# EAGLE board RastoBot-r1 (EAGLE 9.6.2), part 1 of 3
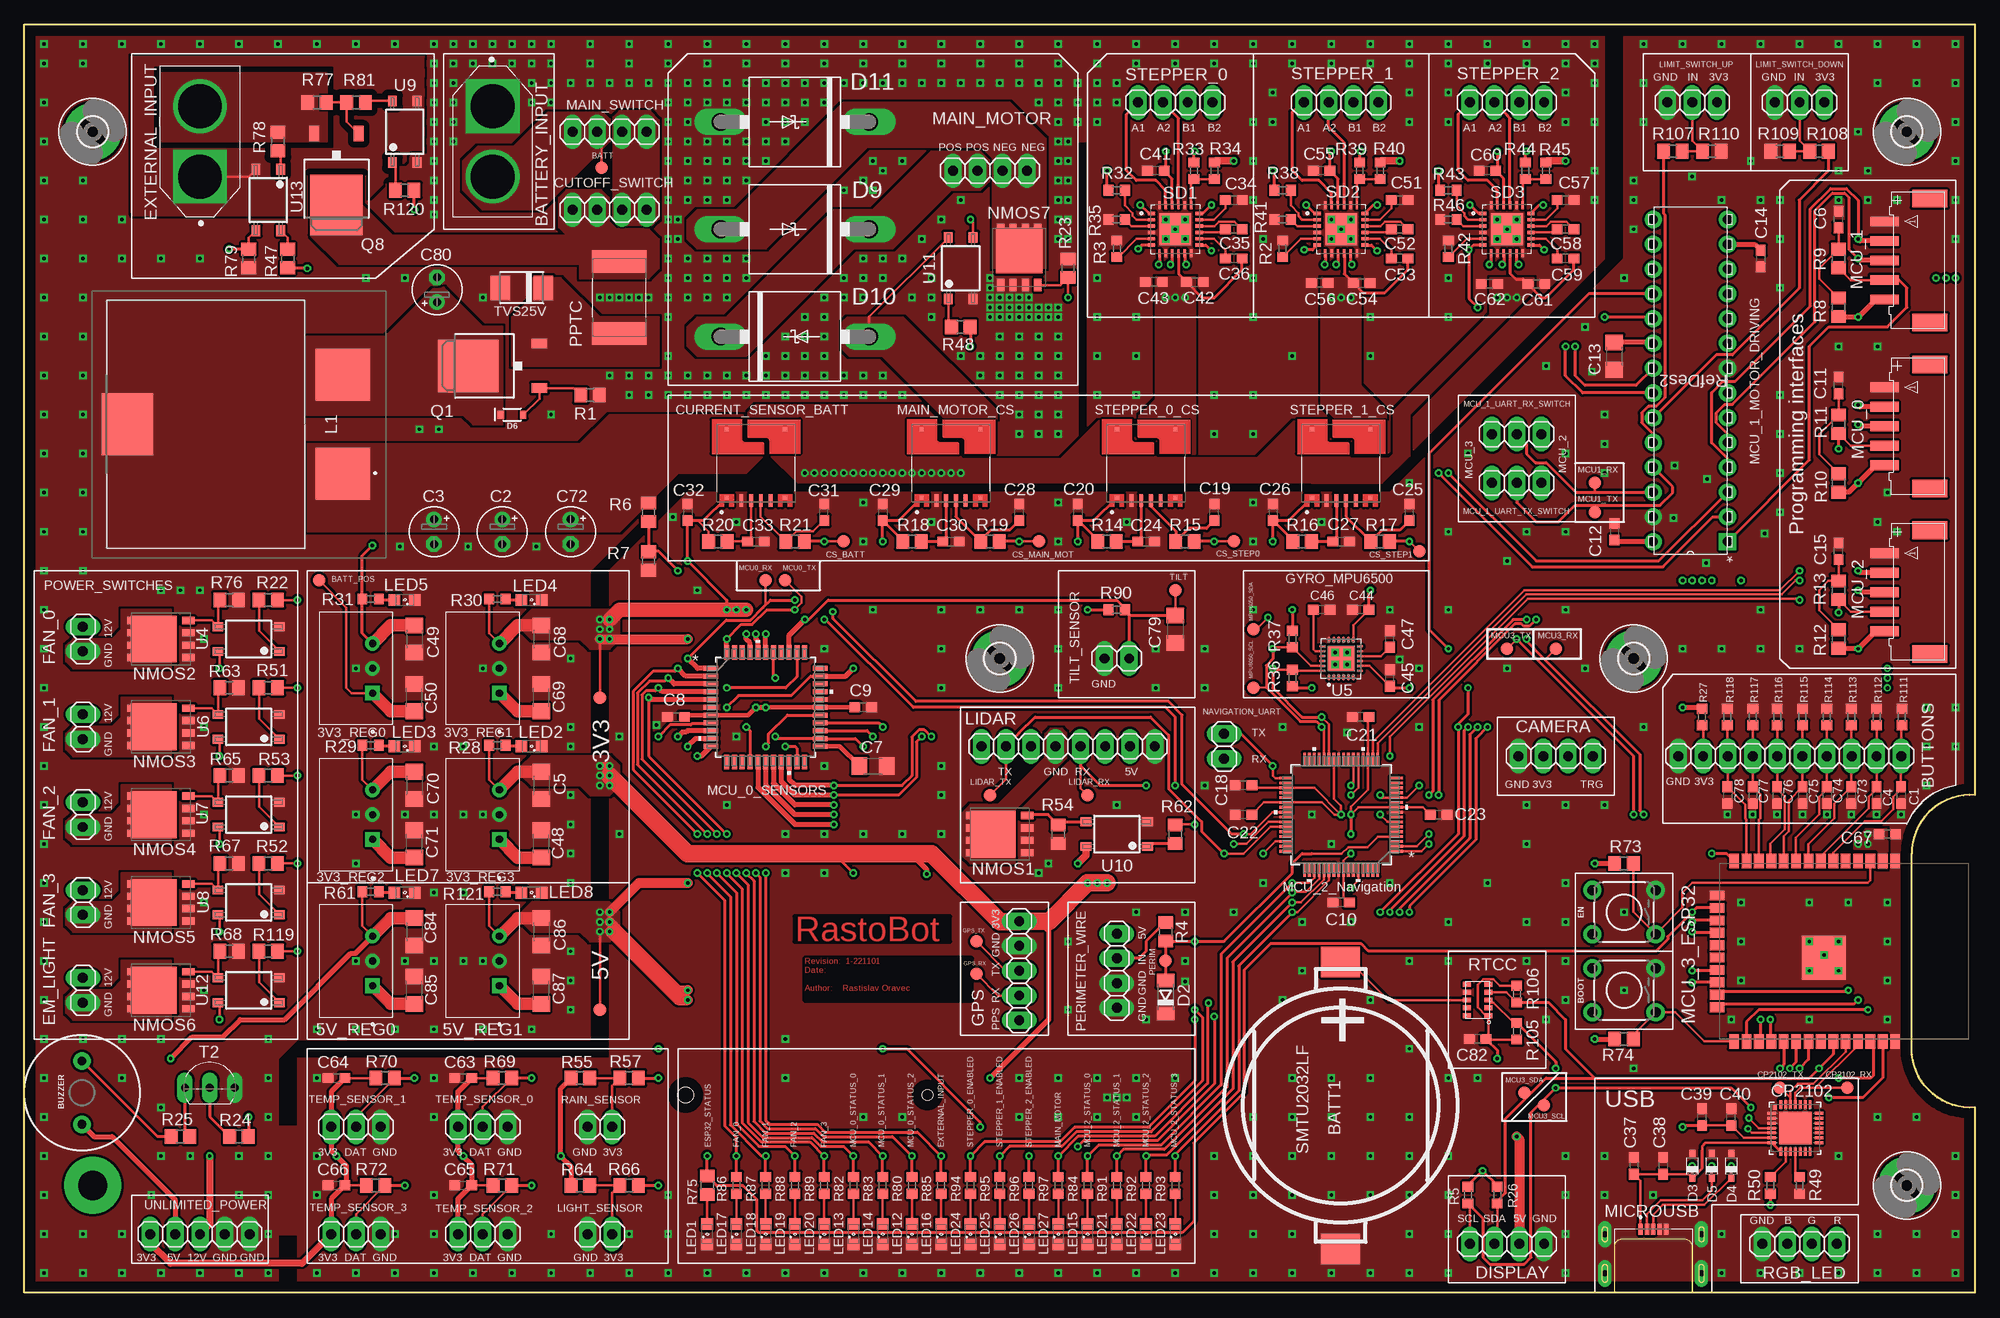
[diagram p11: board, top side]
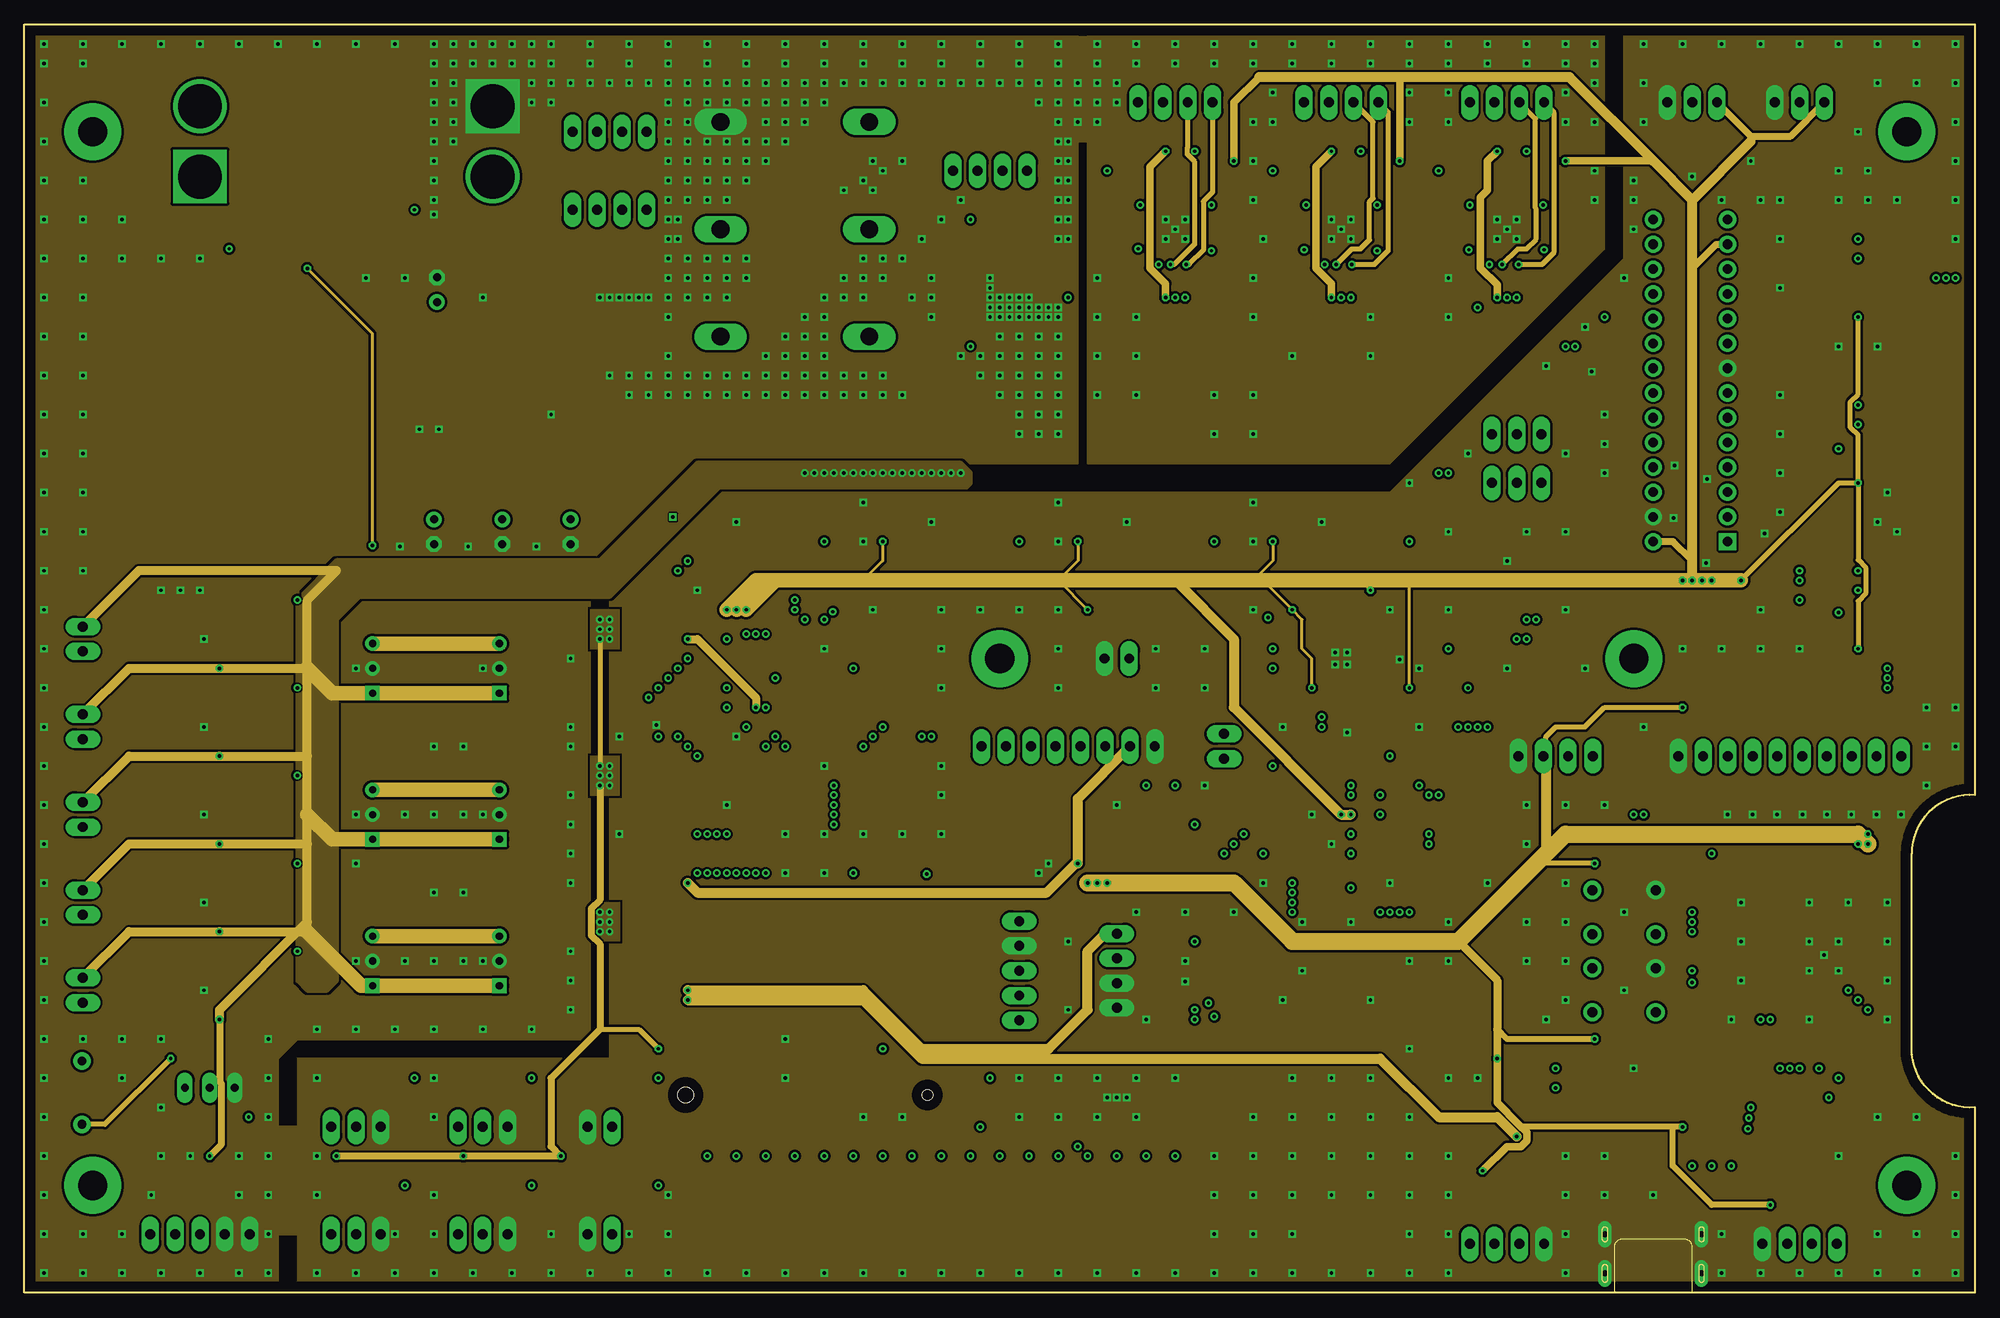
[diagram p12: board, inner layer Route2]
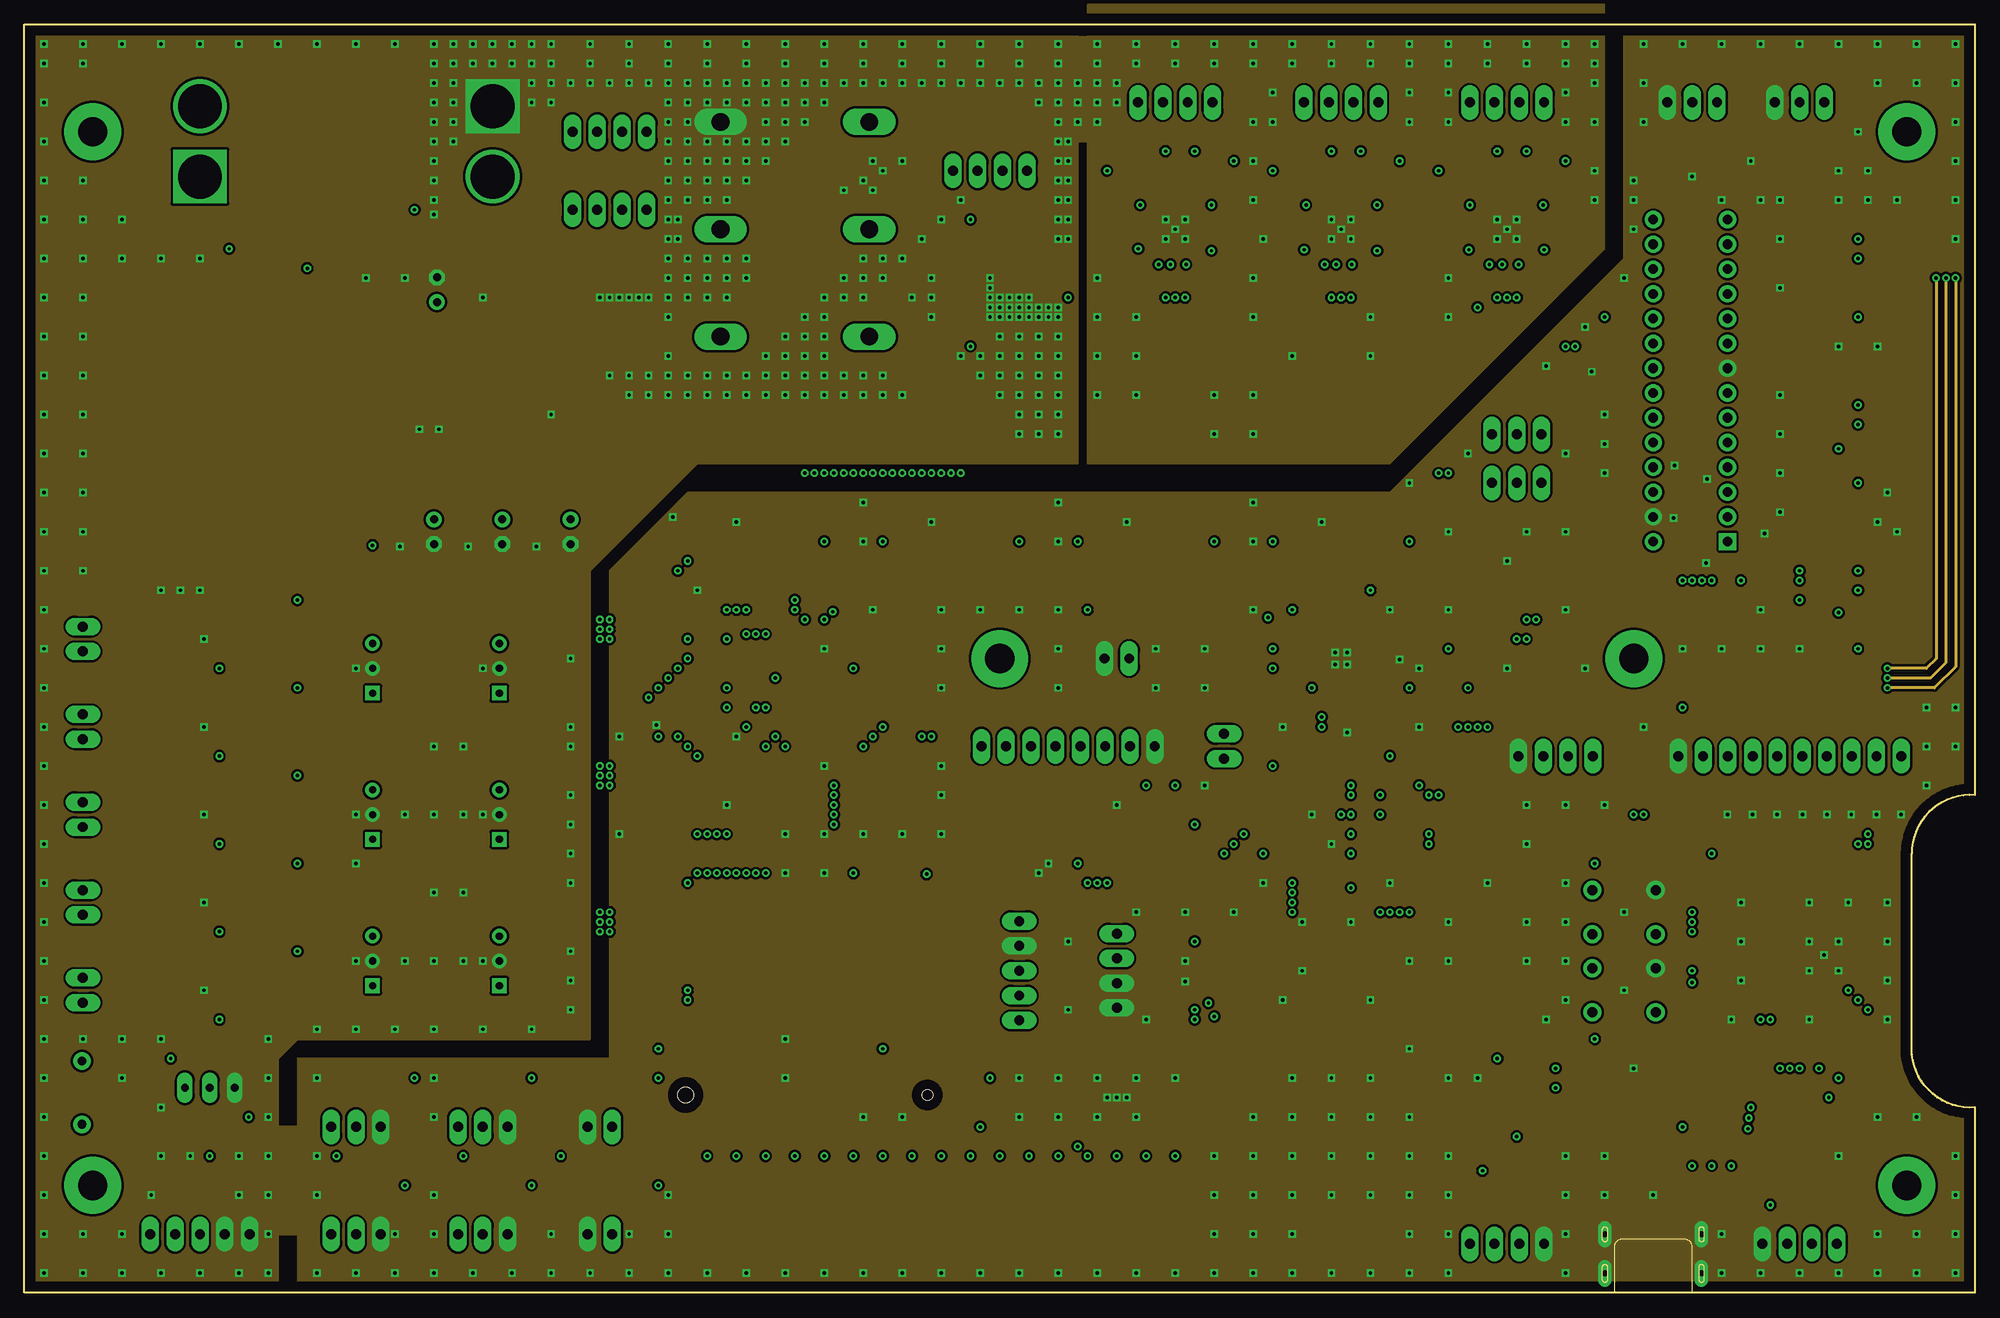
[diagram p13: board, inner layer Route15]
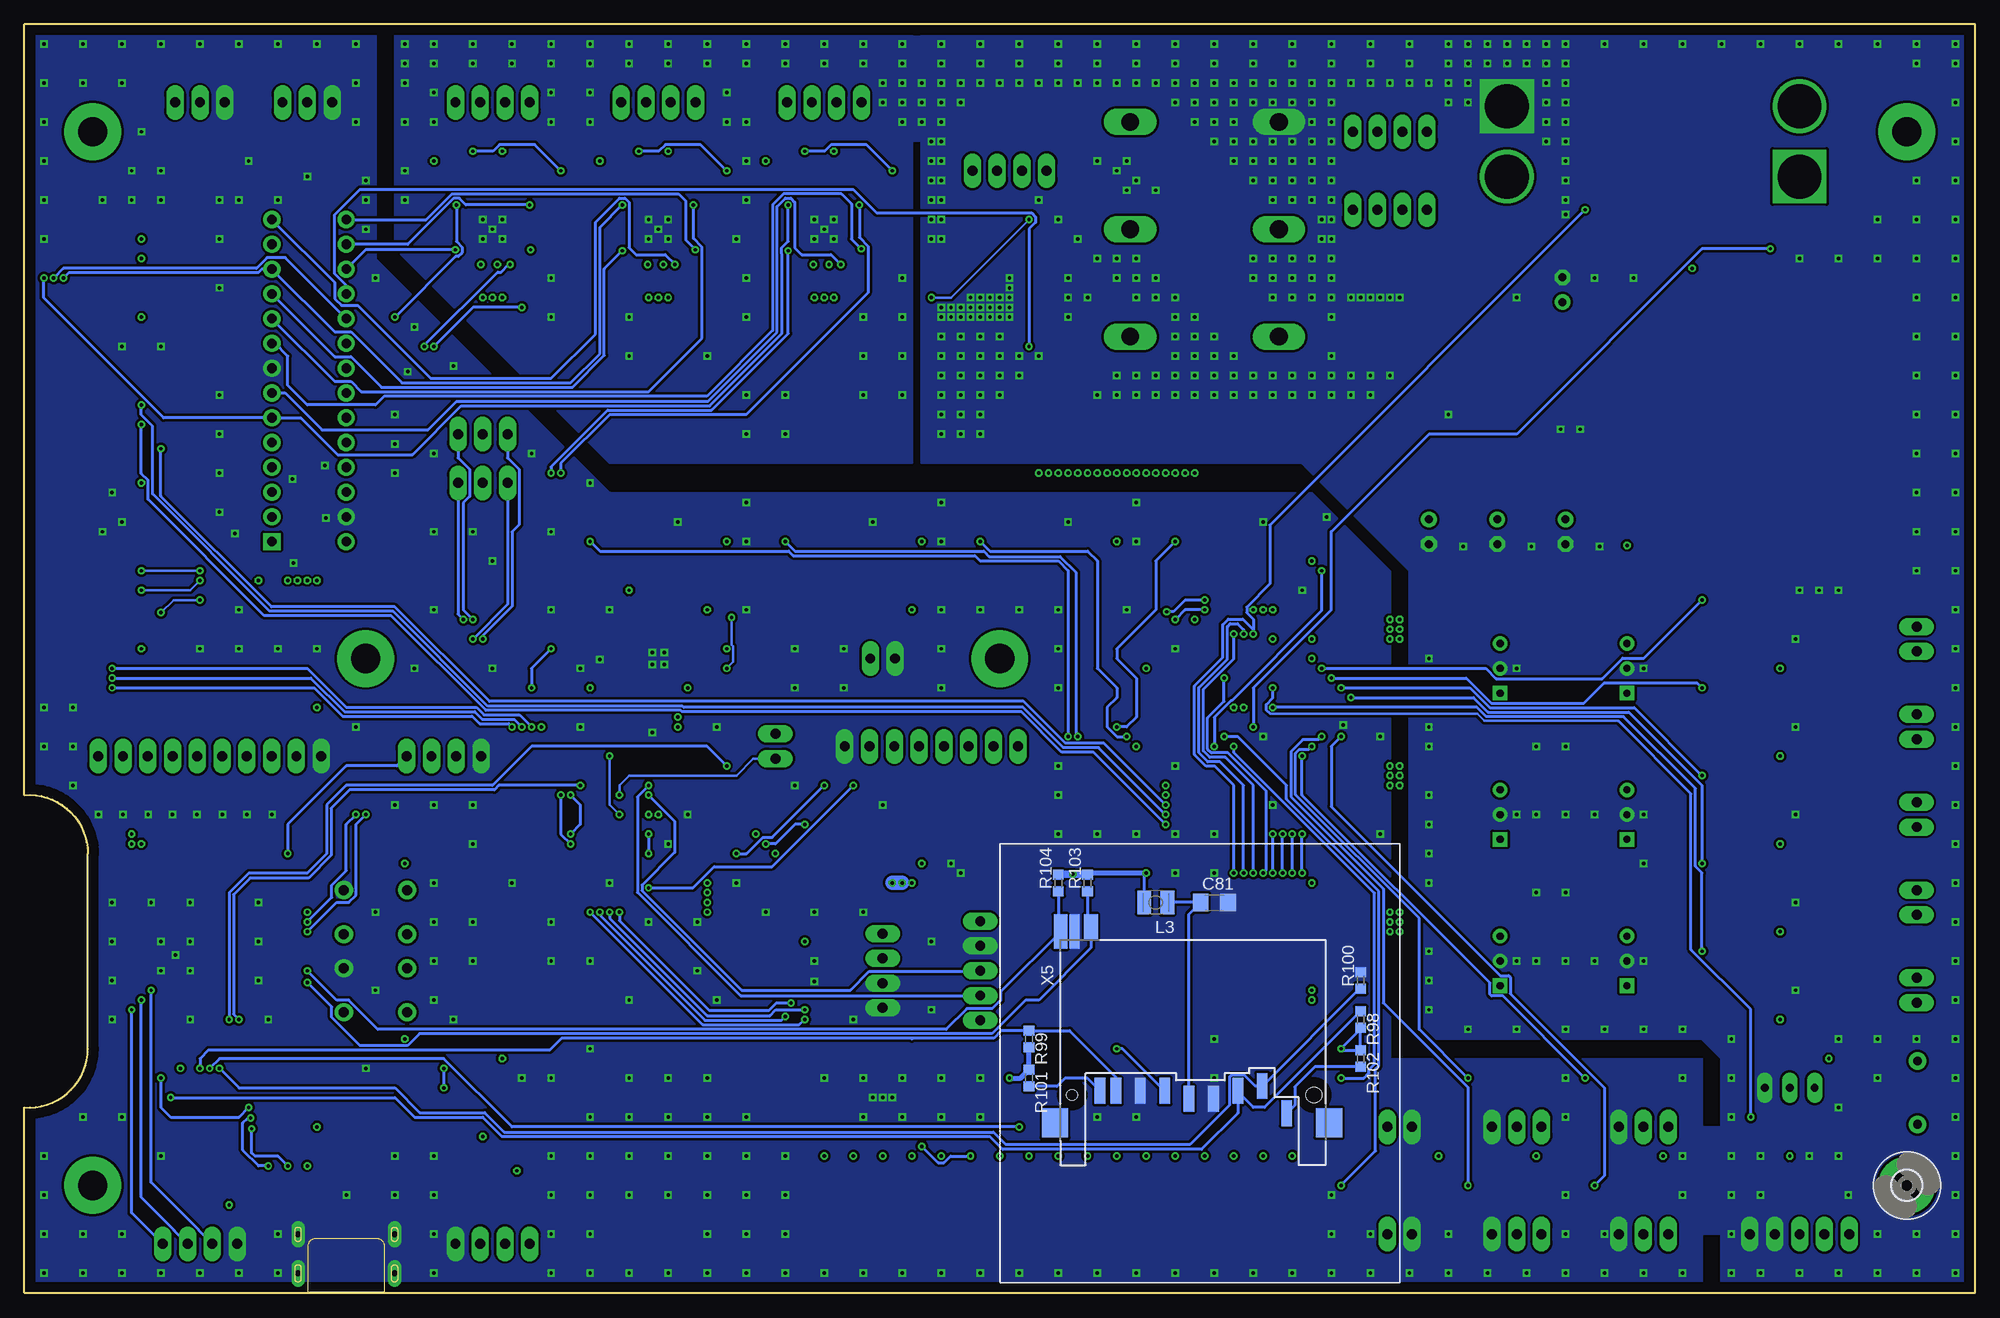
[diagram p14: board, bottom side, seen from below]

Size 200 x 130 mm. Coordinates in mm from the lower left corner, seen from the top.
Outline: 200,0 0,0 0,130 200,130 200,51 arc95 193.5,45 193.5,25 arc95 200,19 200,0
Copper layers (1+2*15+16): Top 0.07mm / dielectric 1.5mm / Route2 0.035mm / dielectric 0.15mm / Route15 0.035mm / dielectric 0.2mm / Bottom 0.07mm
Design rules "default *": minimum track width 6mil, minimum drill 0.35mm, track to track 6mil, track to pad 6mil, pad to pad 6mil, via to via 6mil, smd to smd 6mil, copper to edge 40mil, drill to drill 6mil, minimum pad ring 15mil, minimum via ring 8mil, stop-mask expansion 4mil, vias tented up to drill 40mil, thermal gap 10mil

## Footprints (pad centres in the part's own frame; a part is rotated, then mirrored left to right if it is on the bottom)
CONV_TSR_1-2433E = drill 0.73 pad 1.13 square: 1 -2.54,-1.7 | drill 0.73 pad 1.13: 2 0,-1.7; 3 2.54,-1.7
B1,27 = smd 1.27 x 1.27: TP 0,0
SMTU2032LF = smd 3.1 x 4: MINUS 14.7,0; PLUS -14.7,0
AMASS_XT60-M = drill 4.5 square: 1 -3.6,0 | drill 4.5: 2 3.6,0
TACTILE_SWITCH_PTH_6.0MM = drill 1.016 pad 1.88: 1 -3.251,2.261; 2 3.251,2.261; 3 -3.251,-2.261; 4 3.251,-2.261
1X10 = drill 1.016 long: 1 -11.43,0; 2 -8.89,0; 3 -6.35,0; 4 -3.81,0; 5 -1.27,0; 6 1.27,0; 7 3.81,0; 8 6.35,0; 9 8.89,0; 10 11.43,0
BUZZER-12MM = drill 0.9 pad 1.778: + 3.25,0; - -3.25,0
C0603 = smd 1.1 x 1: 1 -0.85,0; 2 0.85,0
E2,5-5 = drill 0.813 pad 1.6: + -1.27,0 | drill 0.813 pad 1.6 octagon: - 1.27,0
C1206 = smd 1.6 x 1.8: 1 -1.4,0; 2 1.4,0
1X04 = drill 1.016 long: 1 -3.81,0; 2 -1.27,0; 3 1.27,0; 4 3.81,0
MLP28 = smd 0.854 x 0.3: 1 -2.427,1.5; 2 -2.427,1; 3 -2.427,0.5; 4 -2.427,0; 5 -2.427,-0.5; 6 -2.427,-1; 7 -2.427,-1.5; 15 2.427,-1.5; 16 2.427,-1; 17 2.427,-0.5; 18 2.427,0; 19 2.427,0.5; 20 2.427,1; 21 2.427,1.5 | smd 0.3 x 0.854: 8 -1.5,-2.427; 9 -1,-2.427; 10 -0.5,-2.427; 11 0,-2.427; 12 0.5,-2.427; 13 1,-2.427; 14 1.5,-2.427; 22 1.5,2.427; 23 1,2.427; 24 0.5,2.427; 25 0,2.427; 26 -0.5,2.427; 27 -1,2.427; 28 -1.5,2.427 | smd 3.3 x 3.3: EXP 0,0 | smd 0.435 x 0.435: M -2.103,2.103
IC_TLI4971A050T5UE0001XUMA1 = smd 0.4 x 0.4: 1 -3.5,3; 6 -3.5,-3; 7 3.5,-3; 8 3.5,3 | smd 1.3 x 0.4: 2 -3.8,1.5; 3 -3.8,0.5; 4 -3.8,-0.5; 5 -3.8,-1.5
SOD80C = smd 1.4 x 1.8: A 1.7,0; C -1.7,0
SOD323_ST = smd 0.8 x 0.6: A 1.25,0; C -1.25,0
SOD-323 = smd 0.63 x 0.83: A 1.15,0; C -1.15,0
AG = drill 1.803 long: A 7.62,0; C -7.62,0
1X02 = drill 1.016 long: 1 -1.27,0; 2 1.27,0
1X05 = drill 1.016 long: 1 -5.08,0; 2 -2.54,0; 3 0,0; 4 2.54,0; 5 5.08,0
3,0-PAD = drill 3 pad 5.842: B3,0 0,0
SPDIP28_300MC = drill 0.991 square: 1 -7.62,33.02 | drill 0.991: 2 -7.62,30.48; 3 -7.62,27.94; 4 -7.62,25.4; 5 -7.62,22.86; 6 -7.62,20.32; 7 -7.62,17.78; 8 -7.62,15.24; 9 -7.62,12.7; 10 -7.62,10.16; 11 -7.62,7.62; 12 -7.62,5.08; 13 -7.62,2.54; 14 -7.62,0; 15 0,0; 16 0,2.54; 17 0,5.08; 18 0,7.62; 19 0,10.16; 20 0,12.7; 21 0,15.24; 22 0,17.78; 23 0,20.32; 24 0,22.86; 25 0,25.4; 26 0,27.94; 27 0,30.48; 28 0,33.02
74436413300 = smd 5.33 x 5.59: 1 -5.075,-10.66; 2 5.075,-10.66 | smd 6.35 x 5.28: 3 0,11.415
L2825P = smd 1.4 x 2.4: 1 -1.2,0; 2 1.2,0
SML0805 = smd 1.2 x 1.2: A 1.05,0; C -1.05,0
1X08 = drill 1.016 long: 1 -8.89,0; 2 -6.35,0; 3 -3.81,0; 4 -1.27,0; 5 1.27,0; 6 3.81,0; 7 6.35,0; 8 8.89,0
1X03 = drill 1.016 long: 1 -2.54,0; 2 0,0; 3 2.54,0
BM05B-PASS = smd 1.8 x 3.6: A 0.15,-3.35; B -12.55,-3.35 | smd 1 x 2.9: P$1 -2.2,1.3; P$2 -4.2,1.3; P$3 -6.2,1.3; P$4 -8.2,1.3; P$5 -10.2,1.3
ESP-32S = smd 1.5 x 1: 1 -9.25,7; 2 -9.25,5.73; 3 -9.25,4.46; 4 -9.25,3.19; 5 -9.25,1.92; 6 -9.25,0.65; 7 -9.25,-0.62; 8 -9.25,-1.89; 9 -9.25,-3.16; 10 -9.25,-4.43; 11 -9.25,-5.7; 12 -9.25,-6.97; 13 -9.25,-8.24; 14 -9.25,-9.51; 25 9.25,-9.51; 26 9.25,-8.24; 27 9.25,-6.97; 28 9.25,-5.7; 29 9.25,-4.43; 30 9.25,-3.16; 31 9.25,-1.89; 32 9.25,-0.62; 33 9.25,0.65; 34 9.25,1.92; 35 9.25,3.19; 36 9.25,4.46; 37 9.25,5.73; 38 9.25,7 | smd 1 x 1.5: 15 -5.7,-11.25; 16 -4.43,-11.25; 17 -3.16,-11.25; 18 -1.89,-11.25; 19 -0.62,-11.25; 20 0.65,-11.25; 21 1.92,-11.25; 22 3.19,-11.25; 23 4.46,-11.25; 24 5.73,-11.25 | smd 4.5 x 4.5: GND 0.68,-0.33
MOLEX_47642-0001 = smd 0.45 x 1.1: 1 -1.3,0; 2 -0.65,0; 3 0,0; 4 0.65,0; 5 1.3,0 | drill 0.6 pad 1.2 long: S1 -4.95,-0.52; S2 -4.95,-4.52; S3 4.95,-4.52; S4 4.95,-0.52
PG-TDSON-8 = smd 1.3 x 0.75: 1 -2.825,1.905; 2 -2.825,0.635; 3 -2.825,-0.635; 4 -2.825,-1.905; 5 2.825,-1.905; 6 2.825,-0.635; 7 2.825,0.635; 8 2.825,1.905 | smd 4.7 x 4.8: TH 0.725,0
FUSE_0ZCF0075AF2C = smd 2.3 x 5.6: 1 -3.7,0; 2 3.7,0
TO252 = smd 1 x 1.6: 1 -2.28,-4.8; 2 2.28,-4.8 | smd 5.4 x 6.2: 3 0,2.5
R0805 = smd 1.3 x 1.5: 1 -0.95,0; 2 0.95,0
R0603 = smd 1 x 1.1: 1 -0.85,0; 2 0.85,0
AB-RTCMC-32.768KHZ-B5ZE-S3-T = smd 0.5 x 0.8: 1 -1.6,-1.1; 2 -0.8,-1.1; 3 0,-1.1; 4 0.8,-1.1; 5 1.6,-1.1; 6 1.6,1.1; 7 0.8,1.1; 8 0,1.1; 9 -0.8,1.1; 10 -1.6,1.1
QFN65P500X500X100-25N = smd 0.81 x 0.32: 1 -2.45,1.625; 2 -2.45,0.975; 3 -2.45,0.325; 4 -2.45,-0.325; 5 -2.45,-0.975; 6 -2.45,-1.625; 13 2.45,-1.625; 14 2.45,-0.975; 15 2.45,-0.325; 16 2.45,0.325; 17 2.45,0.975; 18 2.45,1.625 | smd 0.32 x 0.81: 7 -1.625,-2.45; 8 -0.975,-2.45; 9 -0.325,-2.45; 10 0.325,-2.45; 11 0.975,-2.45; 12 1.625,-2.45; 19 1.625,2.45; 20 0.975,2.45; 21 0.325,2.45; 22 -0.325,2.45; 23 -0.975,2.45; 24 -1.625,2.45 | smd 3.25 x 3.25: 25 0,0
TO92-CBE = drill 0.813 long: B 0,0; C -2.54,0; E 2.54,0
SUPRESSOR_SMAJ = smd 2 x 2.5: A 2.223,0; C -2.223,0
TQFP44_10X10MC_MCH = smd 1.473 x 0.508: 1 -5.613,4; 2 -5.613,3.2; 3 -5.613,2.4; 4 -5.613,1.6; 5 -5.613,0.8; 6 -5.613,0; 7 -5.613,-0.8; 8 -5.613,-1.6; 9 -5.613,-2.4; 10 -5.613,-3.2; 11 -5.613,-4; 23 5.613,-4; 24 5.613,-3.2; 25 5.613,-2.4; 26 5.613,-1.6; 27 5.613,-0.8; 28 5.613,0; 29 5.613,0.8; 30 5.613,1.6; 31 5.613,2.4; 32 5.613,3.2; 33 5.613,4 | smd 0.508 x 1.473: 12 -4,-5.613; 13 -3.2,-5.613; 14 -2.4,-5.613; 15 -1.6,-5.613; 16 -0.8,-5.613; 17 0,-5.613; 18 0.8,-5.613; 19 1.6,-5.613; 20 2.4,-5.613; 21 3.2,-5.613; 22 4,-5.613; 34 4,5.613; 35 3.2,5.613; 36 2.4,5.613; 37 1.6,5.613; 38 0.8,5.613; 39 0,5.613; 40 -0.8,5.613; 41 -1.6,5.613; 42 -2.4,5.613; 43 -3.2,5.613; 44 -4,5.613
WL-OCPT_SOP4 = smd 1.1 x 0.9: 1 -3.15,1.27; 2 -3.15,-1.27; 3 3.15,-1.27; 4 3.15,1.27
24-VFQFN = smd 0.26 x 0.69: 1 -1.25,-1.92; 2 -0.75,-1.92; 3 -0.25,-1.92; 4 0.25,-1.92; 5 0.75,-1.92; 6 1.25,-1.92; 13 1.25,1.92; 14 0.75,1.92; 15 0.25,1.92; 16 -0.25,1.92; 17 -0.75,1.92; 18 -1.25,1.92 | smd 0.69 x 0.26: 7 1.92,-1.25; 8 1.92,-0.75; 9 1.92,-0.25; 10 1.92,0.25; 11 1.92,0.75; 12 1.92,1.25; 19 -1.92,1.25; 20 -1.92,0.75; 21 -1.92,0.25; 22 -1.92,-0.25; 23 -1.92,-0.75; 24 -1.92,-1.25 | smd 2.7 x 2.6: 25 0,0
TQFP64_PT_MCH = smd 1.346 x 0.279: 1 -5.677,3.75; 2 -5.677,3.25; 3 -5.677,2.75; 4 -5.677,2.25; 5 -5.677,1.75; 6 -5.677,1.25; 7 -5.677,0.75; 8 -5.677,0.25; 9 -5.677,-0.25; 10 -5.677,-0.75; 11 -5.677,-1.25; 12 -5.677,-1.75; 13 -5.677,-2.25; 14 -5.677,-2.75; 15 -5.677,-3.25; 16 -5.677,-3.75; 33 5.677,-3.75; 34 5.677,-3.25; 35 5.677,-2.75; 36 5.677,-2.25; 37 5.677,-1.75; 38 5.677,-1.25; 39 5.677,-0.75; 40 5.677,-0.25; 41 5.677,0.25; 42 5.677,0.75; 43 5.677,1.25; 44 5.677,1.75; 45 5.677,2.25; 46 5.677,2.75; 47 5.677,3.25; 48 5.677,3.75 | smd 0.279 x 1.346: 17 -3.75,-5.677; 18 -3.25,-5.677; 19 -2.75,-5.677; 20 -2.25,-5.677; 21 -1.75,-5.677; 22 -1.25,-5.677; 23 -0.75,-5.677; 24 -0.25,-5.677; 25 0.25,-5.677; 26 0.75,-5.677; 27 1.25,-5.677; 28 1.75,-5.677; 29 2.25,-5.677; 30 2.75,-5.677; 31 3.25,-5.677; 32 3.75,-5.677; 49 3.75,5.677; 50 3.25,5.677; 51 2.75,5.677; 52 2.25,5.677; 53 1.75,5.677; 54 1.25,5.677; 55 0.75,5.677; 56 0.25,5.677; 57 -0.25,5.677; 58 -0.75,5.677; 59 -1.25,5.677; 60 -1.75,5.677; 61 -2.25,5.677; 62 -2.75,5.677; 63 -3.25,5.677; 64 -3.75,5.677
FPS009-3000 = smd 2.65 x 1.1: 1 -0.915,-5.3; 2 -0.415,-7.8; 3 0.385,-10.3; 4 0.385,-12.8; 5 -0.415,-15.3; 6 -0.415,-17.8; 7 -0.415,-20.3; 8 -0.415,-21.925; 9 1.885,-2.8 | smd 3.5 x 1: COM_TERM -16.75,-24.55 | smd 2.5 x 1.4: DETECT -17.25,-22.85 | smd 3 x 2.7: M1 2.85,1.55; M2 2.85,-26.55 | smd 3.5 x 1.4: WRITE_PROT -16.75,-25.95 | hole 1.6: 0,0 | hole 1.1: 0,-24.8

## Placement (x,y rotation side)
3V3_REG0  TSR_1-2433E  [CONV_TSR_1-2433E]  34,64 90 top
3V3_REG1  TSR_1-2433E  [CONV_TSR_1-2433E]  47,64 90 top
3V3_REG2  TSR_1-2433E  [CONV_TSR_1-2433E]  34,49 90 top
3V3_REG3  TSR_1-2433E  [CONV_TSR_1-2433E]  47,49 90 top
5V_REG0  TSR_1-2433E  [CONV_TSR_1-2433E]  34,34 90 top
5V_REG1  TSR_1-2433E  [CONV_TSR_1-2433E]  47,34 90 top
BATT  TPB1,27  [B1,27]  59.2,115.3 0 top
BATT1  SMTU2032LF  [SMTU2032LF]  134.95,19.19 270 top
BATT_POS  TPB1,27  [B1,27]  30.2,73 0 top
BATTERY_INPUT  XT60-M  [AMASS_XT60-M]  48,118 270 top
BOOT  MOMENTARY-SWITCH-SPST-PTH-6.0MM  [TACTILE_SWITCH_PTH_6.0MM]  164,31 180 top
BUTTONS  BUTTONS  [1X10]  181,55 180 top
BUZZER  BUZZER-PTH  [BUZZER-12MM]  5.9,20.5 270 top
C1  10n  [C0603]  192.4,51 270 top
C2  220u  [E2,5-5]  49,78 270 top
C3  220u  [E2,5-5]  42,78 270 top
C4  10n  [C0603]  189.9,51 270 top
C5  4.7u  [C1206]  53,52 270 top
C6  100nF  [C0603]  186,110 90 top
C7  10u 6.3V  [C1206]  87,54 0 top
C8  100nF  [C0603]  66.8,59 0 top
C9  100nF  [C0603]  86,60 180 top
C10  100n  [C0603]  135,40 180 top
C11  100nF  [C0603]  186,93 90 top
C12  100nF  [C0603]  163,78 270 top
C13  10u 6.3V  [C1206]  163,96 270 top
C14  100nF  [C0603]  178,106 270 top
C15  100nF  [C0603]  186,76 90 top
C18  100n  [C0603]  125,52 180 top
C19  6.8nF 25V  [C0603]  122,80 90 top
C20  6.8nF 25V  [C0603]  108,80 270 top
C21  100n  [C0603]  137,59 180 top
C22  100n  [C0603]  125,49 180 top
C23  100n  [C0603]  145,49 0 top
C24  6.8nF 25V  [C0603]  115,77 0 top
C25  6.8nF 25V  [C0603]  142,80 90 top
C26  6.8nF 25V  [C0603]  128,80 270 top
C27  6.8nF 25V  [C0603]  135,77 0 top
C28  6.8nF 25V  [C0603]  102,80 90 top
C29  6.8nF 25V  [C0603]  88,80 270 top
C30  6.8nF 25V  [C0603]  95,77 0 top
C31  6.8nF 25V  [C0603]  82,80 90 top
C32  6.8nF 25V  [C0603]  68,80 270 top
C33  6.8nF 25V  [C0603]  75,77 0 top
C34  220nF  [C0603]  124,112 0 top
C35  100nF  [C0603]  124,109 180 top
C36  100nF  [C0603]  124,106 180 top
C37  1u  [C0603]  165,13 270 top
C38  100n  [C0603]  168,13 270 top
C39  100n  [C0603]  172,18 90 top
C40  4.7u  [C0603]  175,18 90 top
C41  100n  [C0603]  116,115 180 top
C42  100nF  [C0603]  120,103.6 0 top
C43  4.7uF  [C0603]  115.8,103.6 180 top
C44  10nF  [C0603]  137,70 180 top
C45  100nF  [C0603]  140,63 90 top
C46  2.2nF 50V  [C0603]  133,70 180 top
C47  100nF  [C0603]  140,67 90 top
C48  4.7u  [C1206]  53,46 90 top
C49  4.7u  [C1206]  40,67 270 top
C50  4.7u  [C1206]  40,61 90 top
C51  220nF  [C0603]  141,112 0 top
C52  100nF  [C0603]  141,109 180 top
C53  100nF  [C0603]  141,106 180 top
C54  100n  [C0603]  137.1,103.5 0 top
C55  100nF  [C0603]  133,115 180 top
C56  4.7uF  [C0603]  132.8,103.5 180 top
C57  220nF  [C0603]  158,112 0 top
C58  100nF  [C0603]  158,109 180 top
C59  100nF  [C0603]  158,106 180 top
C60  100n  [C0603]  150,115 180 top
C61  100nF  [C0603]  155,103.4 0 top
C62  4.7uF  [C0603]  150.2,103.4 180 top
C63  1u  [C0603]  45,22 0 top
C64  1u  [C0603]  32,22 0 top
C65  1u  [C0603]  45,11 0 top
C66  1u  [C0603]  32,11 0 top
C67  100n  [C0603]  191,47 180 top
C68  4.7u  [C1206]  53,67 270 top
C69  4.7u  [C1206]  53,61 90 top
C70  4.7u  [C1206]  40,52 270 top
C71  4.7u  [C1206]  40,46 90 top
C72  220u  [E2,5-5]  56,78 270 top
C73  10n  [C0603]  187.3,51 270 top
C74  10n  [C0603]  184.8,51 270 top
C75  10n  [C0603]  182.3,51 270 top
C76  10n  [C0603]  179.7,51 270 top
C77  10n  [C0603]  177.2,51 270 top
C78  10n  [C0603]  174.6,51 270 top
C79  100n  [C1206]  118,68 270 top
C80  220u  [E2,5-5]  42.3,102.8 90 top
C81  47u/6V3  [C1206]  78,40 0 bottom
C82  100n  [C0603]  149,26 180 top
C84  4.7u  [C1206]  40,37 270 top
C85  4.7u  [C1206]  40,31 90 top
C86  4.7u  [C1206]  53,37 270 top
C87  4.7u  [C1206]  53,31 90 top
CAMERA  ESP32_CAMERA  [1X04]  157,55 180 top
CP2102  CP2101  [MLP28]  181.57,16.87 0 top
CP2102_RX  TPB1,27  [B1,27]  186.9,21 0 top
CP2102_TX  TPB1,27  [B1,27]  180,21 0 top
CS_BATT  TPB1,27  [B1,27]  84,77 0 top
CS_MAIN_MOT  TPB1,27  [B1,27]  104,77 0 top
CS_STEP0  TPB1,27  [B1,27]  124,77 0 top
CS_STEP1  TPB1,27  [B1,27]  143,76 0 top
CURRENT_SENSOR_BATT  TLI4971A050T5UE0001XUMA1  [IC_TLI4971A050T5UE0001XUMA1]  75,85 90 top
CUTOFF_SWITCH  CUTOFF SWITCH  [1X04]  60,111 180 top
D2  3V3  [SOD80C]  117,30.3 90 top
D3  BAT60J  [SOD323_ST]  171,13 90 top
D4  BAT60J  [SOD323_ST]  175,13 90 top
D5  BAT60J  [SOD323_ST]  173,13 90 top
D6  6.8V  [SOD-323]  50,90 0 top
D9  [AG]  79,109 180 top
D10  [AG]  79,98 0 top
D11  [AG]  79,120 180 top
DISPLAY  DISPLAY  [1X04]  152,5 0 top
EM_LIGHT  EMERGENCY LIGHT  [1X02]  6,31 270 top
EN  MOMENTARY-SWITCH-SPST-PTH-6.0MM  [TACTILE_SWITCH_PTH_6.0MM]  164,39 180 top
EXTERNAL_INPUT  XT60-M  [AMASS_XT60-M]  18,118 90 top
FAN_0  FAN_0  [1X02]  6,67 270 top
FAN_1  FAN_1  [1X02]  6,58 270 top
FAN_2  FAN_2  [1X02]  6,49 270 top
FAN_3  FAN_3  [1X02]  6,40 270 top
GPS  GPS MODULE  [1X05]  102,33 270 top
GPS_RX  TPB1,27  [B1,27]  97.6,32.7 0 top
GPS_TX  TPB1,27  [B1,27]  97.6,36 90 top
H1  MOUNT-PAD-ROUND3.0  [3,0-PAD]  100,65 0 top
H2  MOUNT-PAD-ROUND3.0  [3,0-PAD]  165,65 0 top
H3  MOUNT-PAD-ROUND3.0  [3,0-PAD]  193,11 0 top
H4  MOUNT-PAD-ROUND3.0  [3,0-PAD]  7,11 0 bottom
H5  MOUNT-PAD-ROUND3.0  [3,0-PAD]  193,119 0 top
H6  MOUNT-PAD-ROUND3.0  [3,0-PAD]  7,119 0 top
IC1  PIC24FJ32GA002-X  [SPDIP28_300MC]  167,110 180 top
L1  7443641500  [74436413300]  22,89 90 top
L3  2112805  [L2825P]  84,40 180 bottom
LED1  [SML0805]  70,6 90 top
LED2  [SML0805]  52,56 180 top
LED3  [SML0805]  39,56 180 top
LED4  [SML0805]  52,71 180 top
LED5  [SML0805]  39,71 180 top
LED7  [SML0805]  39,41 180 top
LED8  [SML0805]  52,41 180 top
LED12  [SML0805]  91,6 90 top
LED13  [SML0805]  85,6 90 top
LED14  [SML0805]  88,6 90 top
LED15  [SML0805]  109,6 90 top
LED16  [SML0805]  94,6 90 top
LED17  [SML0805]  73,6 90 top
LED18  [SML0805]  76,6 90 top
LED19  [SML0805]  79,6 90 top
LED20  [SML0805]  82,6 90 top
LED21  [SML0805]  112,6 90 top
LED22  [SML0805]  115,6 90 top
LED23  [SML0805]  118,6 90 top
LED24  [SML0805]  97,6 90 top
LED25  [SML0805]  100,6 90 top
LED26  [SML0805]  103,6 90 top
LED27  [SML0805]  106,6 90 top
LIDAR  LIDAR  [1X08]  107,56 180 top
LIDAR_RX  TPB1,27  [B1,27]  109,51 0 top
LIDAR_TX  TPB1,27  [B1,27]  99,51 0 top
LIGHT_SENSOR  PHOTORESISTOR LDR5549  [1X02]  59,6 180 top
LIMIT_SWITCH_DOWN  LIMIT_SWITCH_BOTTOM_MAGNETIC  [1X03]  182,122 180 top
LIMIT_SWITCH_UP  LIMIT_SWITCH_UPPER_MAGNETIC  [1X03]  171,122 180 top
MAIN_MOTOR  BLADE MOTOR  [1X04]  99,115 0 top
MAIN_MOTOR_CS  TLI4971A050T5UE0001XUMA1  [IC_TLI4971A050T5UE0001XUMA1]  95,85 90 top
MAIN_SWITCH  MAIN SWITCH  [1X04]  60,119 0 top
MCU0_RX  TPB1,27  [B1,27]  76,73 0 top
MCU0_TX  TPB1,27  [B1,27]  78,73 0 top
MCU1_RX  TPB1,27  [B1,27]  161,83 0 top
MCU1_TX  TPB1,27  [B1,27]  161,80 0 top
MCU3_RX  TPB1,27  [B1,27]  157,66 0 top
MCU3_SCL  TPB1,27  [B1,27]  155.8,19.2 0 top
MCU3_SDA  TPB1,27  [B1,27]  153.8,20.5 0 top
MCU3_TX  TPB1,27  [B1,27]  152,66 0 top
MCU_0  BM05B-PASS_STANDARD  [BM05B-PASS]  192,95 90 top
MCU_1  BM05B-PASS_STANDARD  [BM05B-PASS]  192,112 90 top
MCU_1_UART_RX_SWITCH  MOTOR DRIVER UART RX SWITCH  [1X03]  153,88 180 top
MCU_1_UART_TX_SWITCH  MOTOR DRIVER UART TX SWITCH  [1X03]  153,83 180 top
MCU_2  BM05B-PASS_STANDARD  [BM05B-PASS]  192,78 90 top
MCU_3_ESP32  ESP-32S  [ESP-32S]  184.8,35 270 top
MICROUSB  MICROUSB  [MOLEX_47642-0001]  167,6.5 0 top
MPU6050_SCL  TPB1,27  [B1,27]  126,62 0 top
MPU6050_SDA  TPB1,27  [B1,27]  126,68 0 top
NAVIGATION_UART  TELEMETRY_UART  [1X02]  123,56 90 top
NMOS1  BSC340N08NS3G  [PG-TDSON-8]  100,47 180 top
NMOS2  BSC340N08NS3G  [PG-TDSON-8]  14,67 180 top
NMOS3  BSC340N08NS3G  [PG-TDSON-8]  14,58 180 top
NMOS4  BSC340N08NS3G  [PG-TDSON-8]  14,49 180 top
NMOS5  BSC340N08NS3G  [PG-TDSON-8]  14,40 180 top
NMOS6  BSC340N08NS3G  [PG-TDSON-8]  14,31 180 top
NMOS7  BSC340N08NS3G  [PG-TDSON-8]  102,106.1 90 top
PERIM  TPB1,27  [B1,27]  117,34 0 top
PERIMETER_WIRE  PER.WIRE SENSE  [1X04]  112,33 270 top
PPTC  MP005244 16V 12A  [FUSE_0ZCF0075AF2C]  61,102 90 top
Q1  FDD4141TO252  [TO252]  48,95 90 top
Q8  FDD4141TO252  [TO252]  32,114 180 top
R1  100R  [R0805]  58,92 180 top
R2  220k  [R0603]  129,107 270 top
R3  220k  [R0603]  112,107 270 top
R4  1k  [R0805]  117,37 90 top
R5  4.7k  [R0603]  148,10 270 top
R6  1M  [R0805]  64,80 90 top
R7  110k  [R0805]  64,75 90 top
R8  10k  [R0805]  186,101 270 top
R9  1k  [R0805]  186,106 90 top
R10  10k  [R0805]  186,83 270 top
R11  100R  [R0805]  186,89 90 top
R12  10k  [R0805]  186,67 270 top
R13  1k  [R0805]  186,72 90 top
R14  220R  [R0805]  111,77 0 top
R15  220R  [R0805]  119,77 0 top
R16  220R  [R0805]  131,77 0 top
R17  220R  [R0805]  139,77 0 top
R18  220R  [R0805]  91,77 0 top
R19  220R  [R0805]  99,77 0 top
R20  220R  [R0805]  71.1,77 0 top
R21  220R  [R0805]  79,77 0 top
R22  200R  [R0805]  25,71 180 top
R23  1k  [R0805]  107,105 90 top
R24  100R  [R0805]  22,16 180 top
R25  100R  [R0805]  16,16 180 top
R26  4.7k  [R0603]  151,10 270 top
R27  1k  [R0603]  172,59 270 top
R28  100R  [R0603]  48.5,56.1 0 top
R29  100R  [R0603]  35.5,56.1 0 top
R30  100R  [R0603]  48.5,71.1 0 top
R31  100R  [R0603]  35.5,71.1 0 top
R32  1.5k  [R0603]  112,113 0 top
R33  10k  [R0603]  119.9,115 90 top
R34  0R  [R0603]  122,115 270 top
R35  39k  [R0603]  112,110 180 top
R36  4.7k  [R0603]  130,63 90 top
R37  4.7k  [R0603]  130,67 270 top
R38  1.5k  [R0603]  129,113 0 top
R39  10k  [R0603]  136.9,115 90 top
R40  0R  [R0603]  139,115 270 top
R41  39k  [R0603]  129,110 180 top
R42  220k  [R0603]  146,107 270 top
R43  1.5k  [R0603]  146,113 0 top
R44  10k  [R0603]  153.9,115 90 top
R45  0R  [R0603]  156,115 270 top
R46  39k  [R0603]  146,110 180 top
R47  10k  [R0805]  27,106 90 top
R48  100R  [R0805]  96,99 180 top
R49  10k  [R0603]  182,11 90 top
R50  4.7k  [R0603]  179,11 270 top
R51  200R  [R0805]  25,62 180 top
R52  200R  [R0805]  25,44 180 top
R53  200R  [R0805]  25,53 180 top
R54  1k  [R0805]  106,47 270 top
R55  500k  [R0805]  57,22 0 top
R57  10R  [R0805]  62,22 180 top
R61  100R  [R0603]  35.5,41.1 0 top
R62  200R  [R0805]  118,47 270 top
R63  1k  [R0805]  21,62 0 top
R64  500k  [R0805]  57,11 0 top
R65  1k  [R0805]  21,53 0 top
R66  10R  [R0805]  62,11 180 top
R67  1k  [R0805]  21,44 0 top
R68  1k  [R0805]  21,35 0 top
R69  5k  [R0805]  49,22 180 top
R70  5k  [R0805]  37,22 180 top
R71  5k  [R0805]  49,11 180 top
R72  5k  [R0805]  36,11 180 top
R73  12k  [R0805]  164,44 0 top
R74  12k  [R0805]  164,26 180 top
R75  220R  [R0805]  70,11 90 top
R76  1k  [R0805]  21,71 0 top
R77  5K  [R0805]  30,122 0 top
R78  200R  [R0805]  26,118 90 top
R79  10k  [R0805]  23,106 270 top
R80  130R  [R0603]  91,11 270 top
R81  220R  [R0805]  34,122 0 top
R82  130R  [R0603]  85,11 270 top
R83  130R  [R0603]  88,11 270 top
R84  130R  [R0603]  109,11 270 top
R85  130R  [R0603]  94,11 270 top
R86  130R  [R0603]  73,11 270 top
R87  130R  [R0603]  76,11 270 top
R88  130R  [R0603]  79,11 270 top
R89  130R  [R0603]  82,11 270 top
R90  10k  [R0603]  112,70 180 top
R91  130R  [R0603]  112,11 270 top
R92  130R  [R0603]  115,11 270 top
R93  130R  [R0603]  118,11 270 top
R94  130R  [R0603]  97,11 270 top
R95  130R  [R0603]  100,11 270 top
R96  130R  [R0603]  103,11 270 top
R97  130R  [R0603]  106,11 270 top
R98  10k  [R0603]  63,28 270 bottom
R99  10k  [R0603]  97,26 270 bottom
R100  1M  [R0603]  63,32 90 bottom
R101  nc  [R0603]  97,22 270 bottom
R102  nc  [R0603]  63,24 270 bottom
R103  10k  [R0603]  91,42 90 bottom
R104  10k  [R0603]  94,42 90 bottom
R105  4.7k  [R0603]  153,26.8 270 top
R106  4.7k  [R0603]  153,30.6 90 top
R107  10k  [R0805]  169,117 0 top
R108  10k  [R0805]  184,117 180 top
R109  10k  [R0805]  180,117 0 top
R110  10k  [R0805]  173,117 180 top
R111  10k  [R0603]  192.5,59 90 top
R112  10k  [R0603]  189.9,59 90 top
R113  10k  [R0603]  187.3,59 90 top
R114  10k  [R0603]  184.8,59 90 top
R115  10k  [R0603]  182.3,59 90 top
R116  10k  [R0603]  179.7,59 90 top
R117  10k  [R0603]  177.2,59 90 top
R118  10k  [R0603]  174.6,59 90 top
R119  200R  [R0805]  25,35 180 top
R120  200R  [R0805]  39,113 180 top
R121  100R  [R0603]  48.5,41.1 0 top
RAIN_SENSOR  RAIN SENSOR  [1X02]  59,17 180 top
RGB_LED  RGB_LED  [1X04]  182,5 180 top
RTCC  [AB-RTCMC-32.768KHZ-B5ZE-S3-T]  149,30 90 top
SD1  MP6500  [QFN65P500X500X100-25N]  118,109 0 top
SD2  MP6500  [QFN65P500X500X100-25N]  135,109 0 top
SD3  MP6500  [QFN65P500X500X100-25N]  152,109 0 top
STEPPER_0  STEPPER_0  [1X04]  118,122 0 top
STEPPER_0_CS  TLI4971A050T5UE0001XUMA1  [IC_TLI4971A050T5UE0001XUMA1]  115,85 90 top
STEPPER_1  STEPPER_1  [1X04]  135,122 0 top
STEPPER_1_CS  TLI4971A050T5UE0001XUMA1  [IC_TLI4971A050T5UE0001XUMA1]  135,85 90 top
STEPPER_2  STEPPER_2  [1X04]  152,122 0 top
T2  2N2222A  [TO92-CBE]  19,21 0 top
TEMP_SENSOR_0  TEMP SENSOR 0  [1X03]  47,17 0 top
TEMP_SENSOR_1  TEMP SENSOR 1  [1X03]  34,17 0 top
TEMP_SENSOR_2  TEMP SENSOR 2  [1X03]  47,6 0 top
TEMP_SENSOR_3  TEMP SENSOR 3  [1X03]  34,6 0 top
TILT  TPB1,27  [B1,27]  118,72 0 top
TILT_SENSOR  TILT SENSOR  [1X02]  112,65 0 top
TP2  TPB1,27  [B1,27]  59,29 0 top
TP3  TPB1,27  [B1,27]  59,61 0 top
TVS25V  SUPRESSOR_TVS-UD-SMAJ  [SUPRESSOR_SMAJ]  51,103 180 top
U1  PIC18F47J13-I/PT  [TQFP44_10X10MC_MCH]  76,60 0 top
U4  140357145000  [WL-OCPT_SOP4]  23,67 180 top
U5  MPU-6050  [24-VFQFN]  135,65 0 top
U6  140357145000  [WL-OCPT_SOP4]  23,58 180 top
U7  140357145000  [WL-OCPT_SOP4]  23,49 180 top
U8  140357145000  [WL-OCPT_SOP4]  23,40 180 top
U9  140357145000  [WL-OCPT_SOP4]  39,119 90 top
U10  140357145000  [WL-OCPT_SOP4]  112,47 180 top
U11  140357145000  [WL-OCPT_SOP4]  96,105 90 top
U12  140357145000  [WL-OCPT_SOP4]  23,31 180 top
U13  140357145000  [WL-OCPT_SOP4]  25,112 270 top
U15  PIC32MK1024MCM064-I/PTTQFP64_PT_MCH  [TQFP64_PT_MCH]  135,49 180 top
UNLIMITED_POWER  V_OUTPUT  [1X05]  18,6 0 top
X5  FPS009-3000  [FPS009-3000]  67.79,20.27 270 bottom